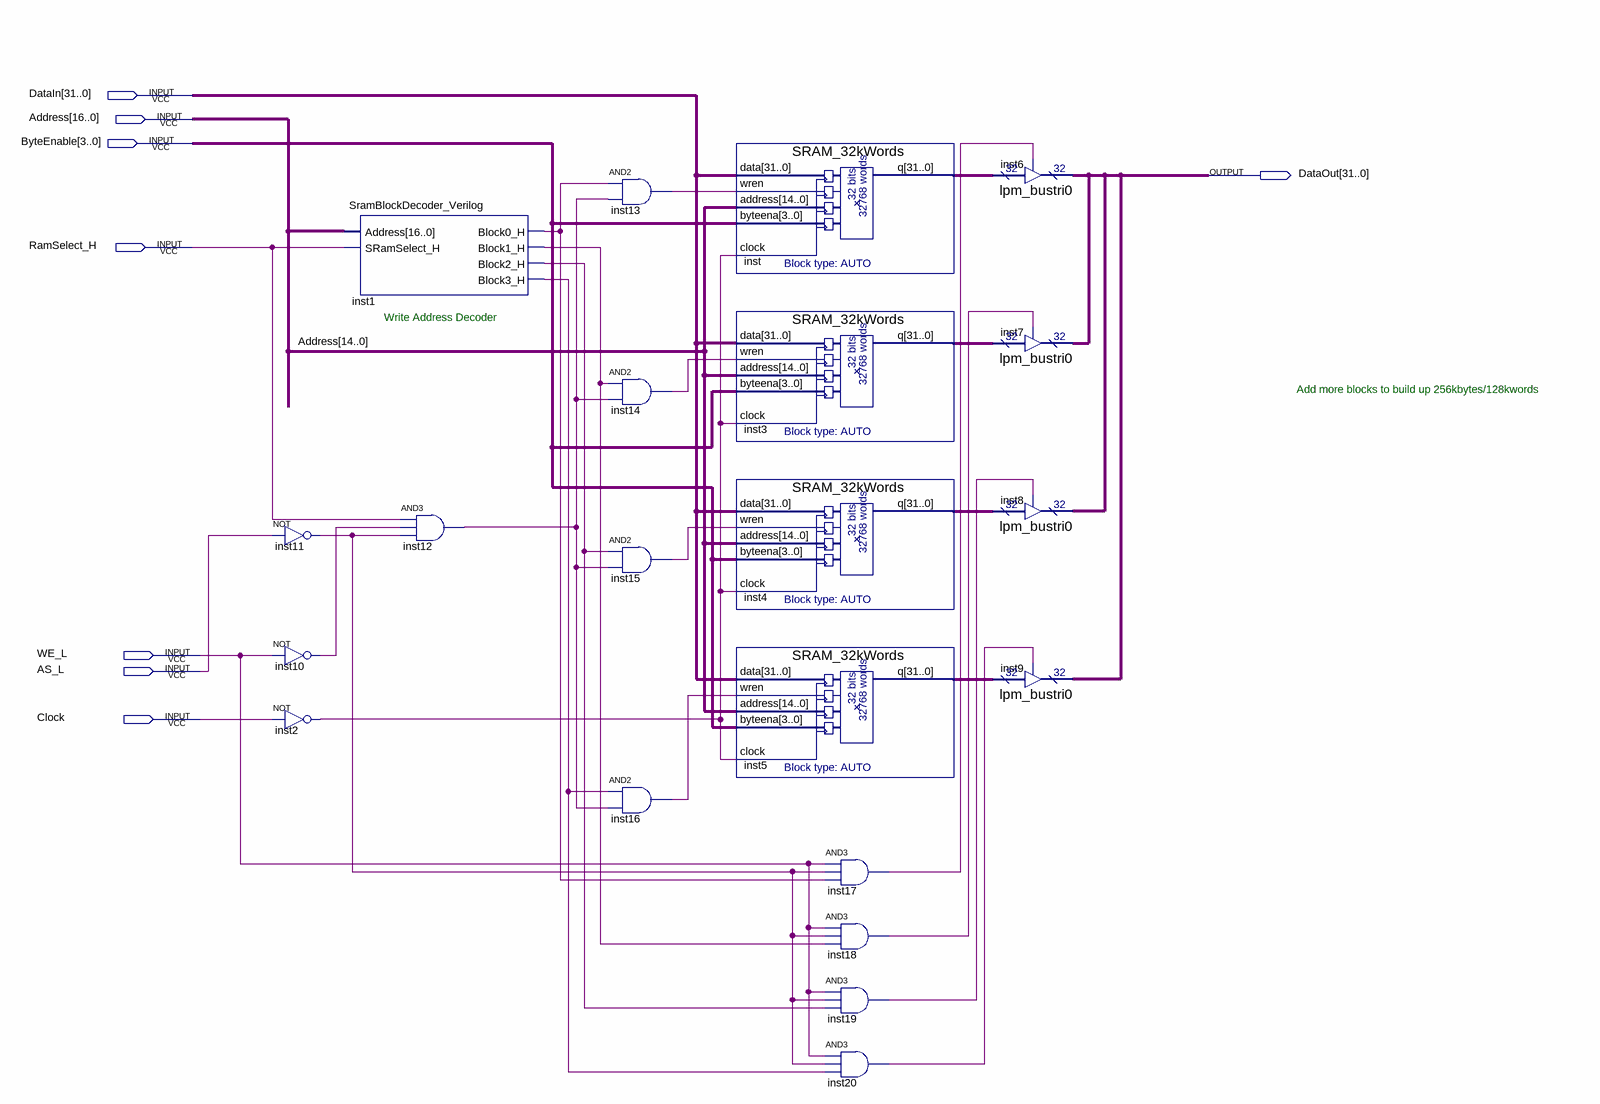
[diagram p0: schematic sheet]
// Quartus schematic OnChipRam256kbyte.bdf as structural Verilog: 21 symbols, 8 pins
module OnChipRam256kbyte (
  input  [31:0] DataIn,
  input  [16:0] Address,
  input  [3:0] ByteEnable,
  input  RamSelect_H,
  input  WE_L,
  input  AS_L,
  input  Clock,
  output [31:0] DataOut
);

  wire inst1_block0_h, inst1_block1_h, inst1_block2_h, inst1_block3_h, inst2_out, inst10_out, inst11_out,
       inst12_out, inst13_out, inst14_out, inst15_out, inst16_out, inst17_out, inst18_out, inst19_out,
       inst20_out;
  wire [31:0] inst3_q, inst4_q, inst5_q, inst_q;

  not inst11 (inst11_out, AS_L);
  not inst10 (inst10_out, WE_L);
  not inst2 (inst2_out, Clock);
  SramBlockDecoder_Verilog inst1 (
    .Address(Address), .SRamSelect_H(RamSelect_H), .Block0_H(inst1_block0_h), .Block1_H(inst1_block1_h),
    .Block2_H(inst1_block2_h), .Block3_H(inst1_block3_h));
  and inst12 (inst12_out, RamSelect_H, inst10_out, inst11_out);
  and inst13 (inst13_out, inst1_block0_h, inst12_out);
  and inst14 (inst14_out, inst1_block1_h, inst12_out);
  and inst15 (inst15_out, inst1_block2_h, inst12_out);
  and inst16 (inst16_out, inst1_block3_h, inst12_out);
  SRAM_32kWords inst (
    .data(DataIn), .wren(inst13_out), .address(Address[14:0]), .byteena(ByteEnable), .clock(inst2_out),
    .q(inst_q));
  SRAM_32kWords inst3 (
    .data(DataIn), .wren(inst14_out), .address(Address[14:0]), .byteena(ByteEnable), .clock(inst2_out),
    .q(inst3_q));
  SRAM_32kWords inst4 (
    .data(DataIn), .wren(inst15_out), .address(Address[14:0]), .byteena(ByteEnable), .clock(inst2_out),
    .q(inst4_q));
  SRAM_32kWords inst5 (
    .data(DataIn), .wren(inst16_out), .address(Address[14:0]), .byteena(ByteEnable), .clock(inst2_out),
    .q(inst5_q));
  and inst17 (inst17_out, WE_L, inst11_out, inst1_block0_h);
  and inst18 (inst18_out, WE_L, inst11_out, inst1_block1_h);
  and inst19 (inst19_out, WE_L, inst11_out, inst1_block2_h);
  and inst20 (inst20_out, WE_L, inst11_out, inst1_block3_h);
  lpm_bustri0 inst6 (.enabledt(inst17_out), .data(inst_q), .tridata(DataOut));
  lpm_bustri0 inst7 (.enabledt(inst18_out), .data(inst3_q), .tridata(DataOut));
  lpm_bustri0 inst8 (.enabledt(inst19_out), .data(inst4_q), .tridata(DataOut));
  lpm_bustri0 inst9 (.enabledt(inst20_out), .data(inst5_q), .tridata(DataOut));

  // Notes on the sheet:
  //   Write Address Decoder
  //   Add more blocks to build up 256kbytes/128kwords
endmodule
